# Altium project Graduation_Design.PrjPcb
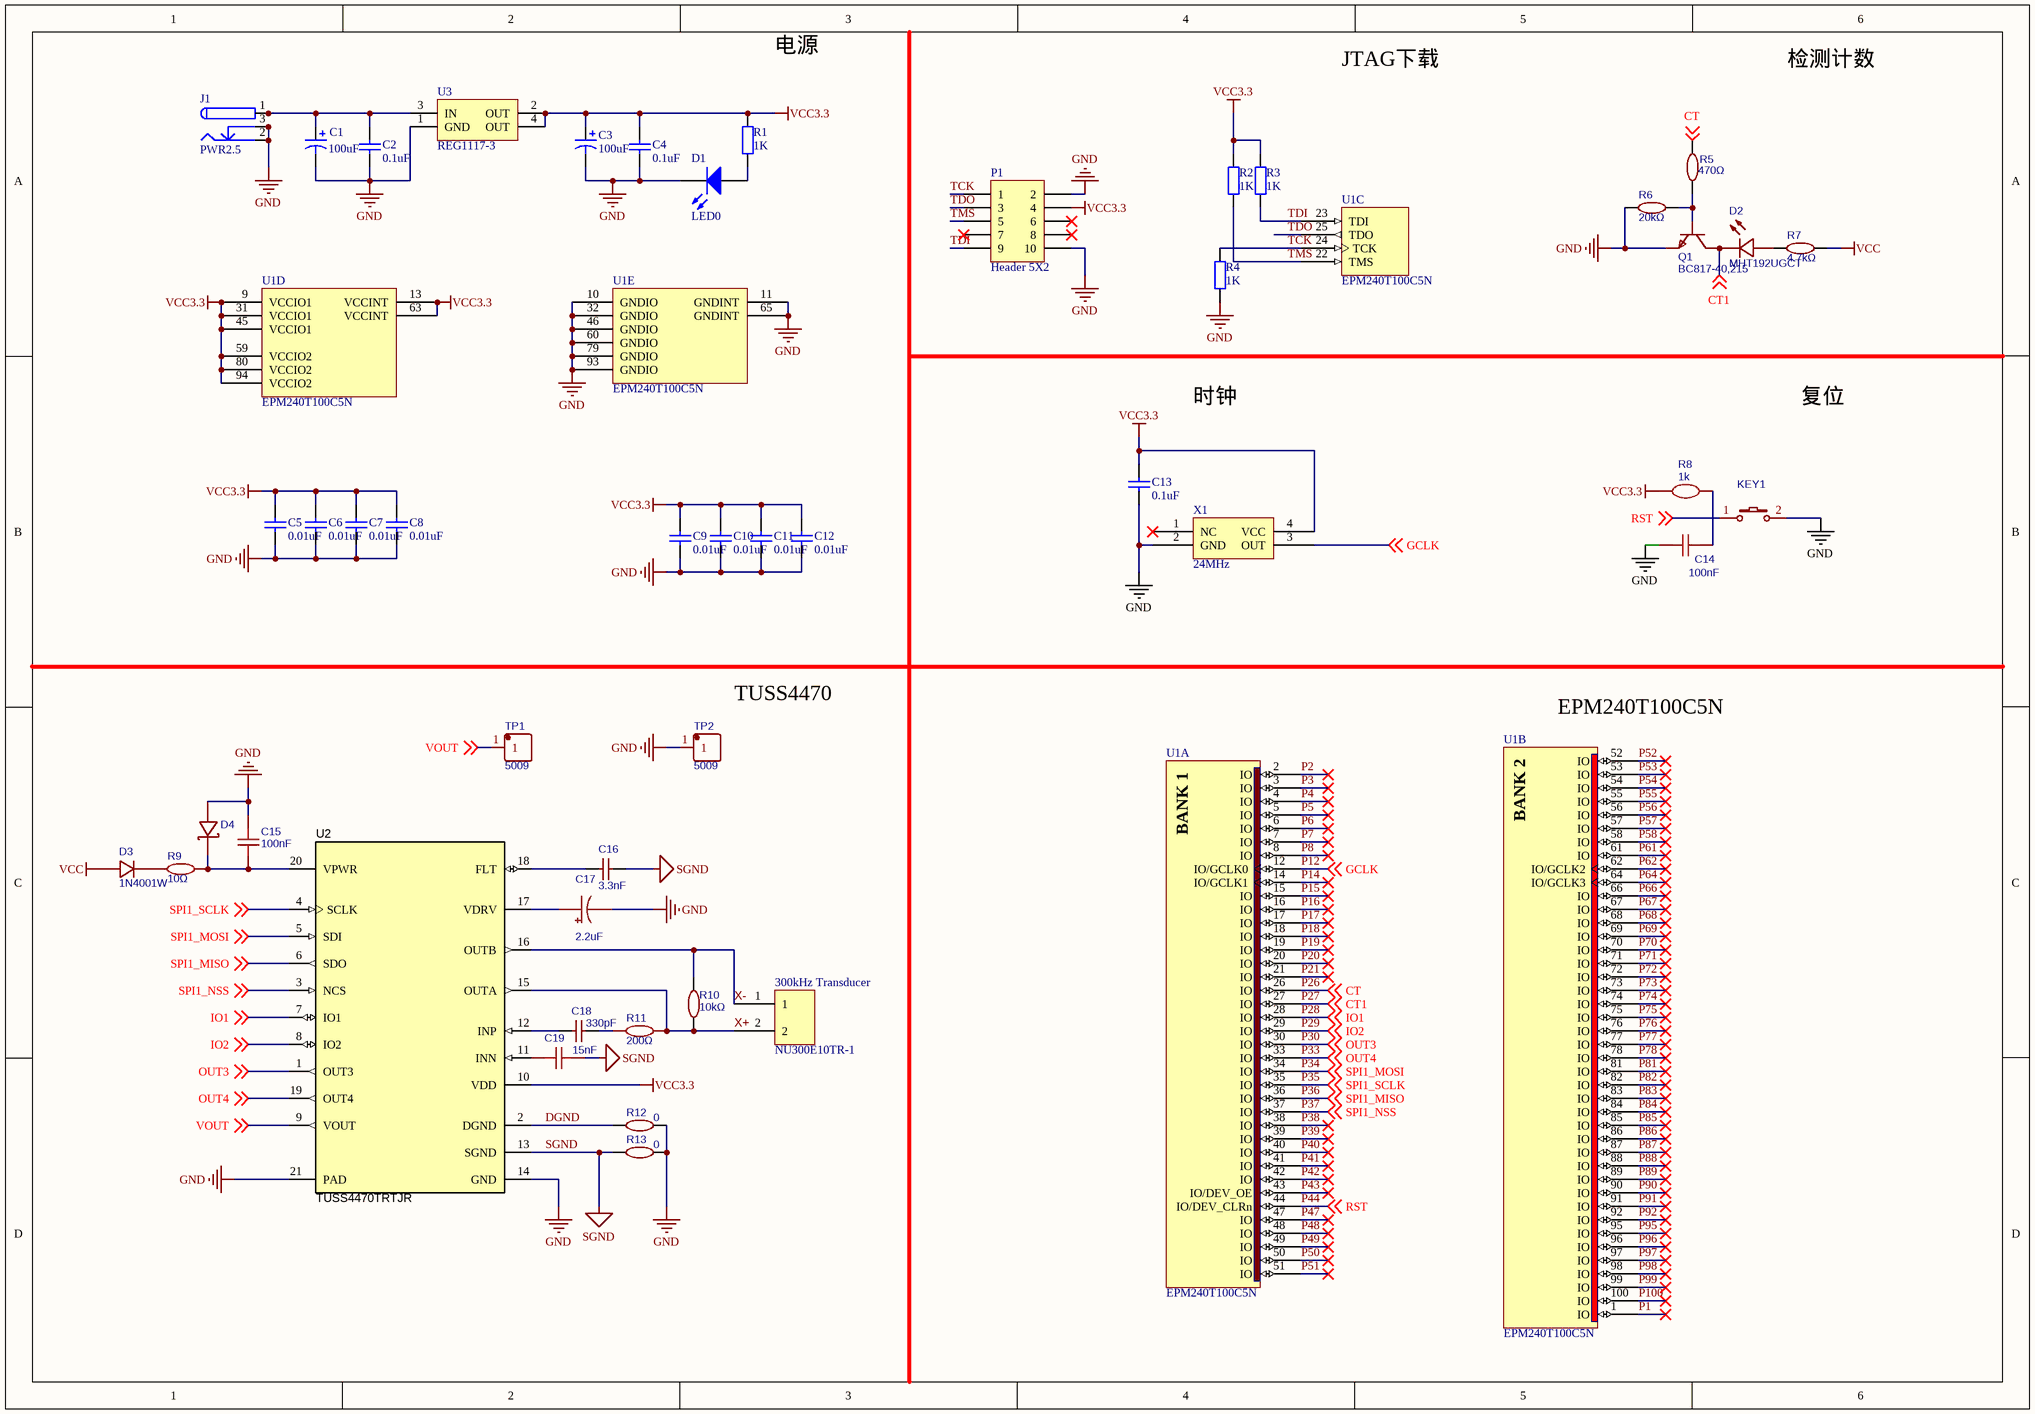
[diagram p0: 超声波接近电路2-22.SchDoc]
1 sheet, 47 parts. Net scope: global (net labels, ports and power ports of the same name join across sheets).
Board file: 超声波接近电路2-22PcbDoc.PcbDoc

## Sheet 超声波接近电路2-22.SchDoc
size 381 x 264 mm; SheetNumber: 1; SheetTotal: 1

### Parts
300kHz_Transducer  NU300E10TR-1  [NU300E10TR-1]
C1  value 100uF  [CAP-SMD_L3.2-W1.6-RD]  (hidden comment: Cap Pol1)
C2  value 0.1uF  [C0603]  (hidden comment: Cap)
C3  value 100uF  [CAP-SMD_L3.2-W1.6-RD]  (hidden comment: Cap Pol1)
C4  value 0.1uF  [C0603]  (hidden comment: Cap)
C5  value 0.01uF  [C0603]  (hidden comment: Cap)
C6  value 0.01uF  [C0603]  (hidden comment: Cap)
C7  value 0.01uF  [C0603]  (hidden comment: Cap)
C8  value 0.01uF  [C0603]  (hidden comment: Cap)
C9  value 0.01uF  [C0603]  (hidden comment: Cap)
C10  value 0.01uF  [C0603]  (hidden comment: Cap)
C11  value 0.01uF  [C0603]  (hidden comment: Cap)
C12  value 0.01uF  [C0603]  (hidden comment: Cap)
C13  value 0.1uF  [C0603]  (hidden comment: Cap)
C14  100nF  [C0603]
C15  100nF  [C0603]
C16  3.3nF  [C0603]
C17  2.2uF  [CAP-SMD_L3.2-W1.6-RD]
C18  330pF  [C0603]
C19  15nF  [C0603]
D1  LED0  [LED0603-RD_RED]
D2  MHT192UGCT  [LED0603-RD_GREEN]
D3  1N4001W  [SOD-123F_L2.8-W1.8-LS3.7-RD]
D4  SMF36A_C353286  [SOD-123FL_L2.7-W1.8-LS3.8-RD]  (value not drawn)
J1  PWR2.5  [KLD-0202]
KEY1  K2-3.6×6.1_SMD  [KEY-SMD_2P-L6.2-W3.6-LS8.0]  (value not drawn)
P1  Header 5X2  [HDR2X5]
Q1  BC817-40,215  [SOT-23-3_L2.9-W1.6-P1.90-LS2.8-BR]
R1  value 1K  [R0603]  (hidden comment: Res2)
R2  value 1K  [R0603]  (hidden comment: Res2)
R3  value 1K  [R0603]  (hidden comment: Res2)
R4  value 1K  [R0603]  (hidden comment: Res2)
R5  470Ω  [R0603]
R6  20kΩ  [R0603]
R7  4.7kΩ  [R0603]
R8  1k  [R0603]
R9  10Ω  [R0603]
R10  10kΩ  [R0603]
R11  200Ω  [R0603]
R12  0  [R0603]
R13  0  [R0603]
TP1  5009  [TEST-TH_BD3.18-P1.93]
TP2  5009  [TEST-TH_BD3.18-P1.93]
U1  EPM240T100C5N  [TQFP-100_L14.0-W14.0-P0.50-LS16.0-BL]  (parts A,B,C,D,E of 5)
U2  TUSS4470TRTJR  [QFN-20_L4.0-W4.0-P0.50-TL-EP2.7]
U3  REG1117-3  [ZZ311]
X1  24MHz  [OSC-SMD_4P-L7.0-W5.0-BL_SIT1602]

### Nets
GND: C1.2 C2.2 C3.2 C4.2 C5.1 C6.1 C7.1 C8.1 C9.1 C10.1 C11.1 C12.1 C13.1 C14.2 C15.2 C17.2 D1.2(K) D4.2(A) J1.2 J1.2A J1.2B J1.3 J1.3A J1.3B KEY1.2 P1.2 P1.10 Q1.2 R4.1 R6.1 R12.2 R13.2 TP2.1 U1.10(GNDIO) U1.11(GNDINT) U1.32(GNDIO) U1.46(GNDIO) U1.60(GNDIO) U1.65(GNDINT) U1.79(GNDIO) U1.93(GNDIO) U2.14(GND) U2.21(PAD) U3.1(GND) X1.2(GND)
SGND: C16.2 C19.2 R13.1 U2.13(SGND)
VCC: D3.2(A) R7.2
VCC3.3: C3.1 C4.1 C5.2 C6.2 C7.2 C8.2 C9.2 C10.2 C11.2 C12.2 C13.2 P1.4 R1.2 R2.2 R3.2 R8.2 U1.9(VCCIO1) U1.13(VCCINT) U1.31(VCCIO1) U1.45(VCCIO1) U1.59(VCCIO2) U1.63(VCCINT) U1.80(VCCIO2) U1.94(VCCIO2) U2.10(VDD) U3.2(OUT) U3.4(OUT) X1.4(VCC)
DGND: R12.1 U2.2(DGND)
P1: U1.1(IO)
P2: U1.2(IO)
P3: U1.3(IO)
P4: U1.4(IO)
P5: U1.5(IO)
P6: U1.6(IO)
P7: U1.7(IO)
P8: U1.8(IO)
P12: U1.12(IO/GCLK0) X1.3(OUT) ; off-sheet GCLK  [also labelled GCLK]
P14: U1.14(IO/GCLK1)
P15: U1.15(IO)
P16: U1.16(IO)
P17: U1.17(IO)
P18: U1.18(IO)
P19: U1.19(IO)
P20: U1.20(IO)
P21: U1.21(IO)
P26: R5.1 U1.26(IO) ; off-sheet CT  [also labelled CT]
P27: D2.1(-) Q1.3 U1.27(IO) ; off-sheet CT1  [also labelled CT1]
P28: U1.28(IO) U2.7(IO1) ; off-sheet IO1  [also labelled IO1]
P29: U1.29(IO) U2.8(IO2) ; off-sheet IO2  [also labelled IO2]
P30: U1.30(IO) U2.1(OUT3) ; off-sheet OUT3  [also labelled OUT3]
P33: U1.33(IO) U2.19(OUT4) ; off-sheet OUT4  [also labelled OUT4]
P34: U1.34(IO) U2.5(SDI) ; off-sheet SPI1_MOSI  [also labelled SPI1_MOSI]
P35: U1.35(IO) U2.4(SCLK) ; off-sheet SPI1_SCLK  [also labelled SPI1_SCLK]
P36: U1.36(IO) U2.6(SDO) ; off-sheet SPI1_MISO  [also labelled SPI1_MISO]
P37: U1.37(IO) U2.3(NCS) ; off-sheet SPI1_NSS  [also labelled SPI1_NSS]
P38: U1.38(IO)
P39: U1.39(IO)
P40: U1.40(IO)
P41: U1.41(IO)
P42: U1.42(IO)
P43: U1.43(IO/DEV_OE)
P44: KEY1.1 U1.44(IO/DEV_CLRn) ; off-sheet RST  [also labelled RST]
P47: U1.47(IO)
P48: U1.48(IO)
P49: U1.49(IO)
P50: U1.50(IO)
P51: U1.51(IO)
P52: U1.52(IO)
P53: U1.53(IO)
P54: U1.54(IO)
P55: U1.55(IO)
P56: U1.56(IO)
P57: U1.57(IO)
P58: U1.58(IO)
P61: U1.61(IO)
P62: U1.62(IO/GCLK2)
P64: U1.64(IO/GCLK3)
P66: U1.66(IO)
P67: U1.67(IO)
P68: U1.68(IO)
P69: U1.69(IO)
P70: U1.70(IO)
P71: U1.71(IO)
P72: U1.72(IO)
P73: U1.73(IO)
P74: U1.74(IO)
P75: U1.75(IO)
P76: U1.76(IO)
P77: U1.77(IO)
P78: U1.78(IO)
P81: U1.81(IO)
P82: U1.82(IO)
P83: U1.83(IO)
P84: U1.84(IO)
P85: U1.85(IO)
P86: U1.86(IO)
P87: U1.87(IO)
P88: U1.88(IO)
P89: U1.89(IO)
P90: U1.90(IO)
P91: U1.91(IO)
P92: U1.92(IO)
P95: U1.95(IO)
P96: U1.96(IO)
P97: U1.97(IO)
P98: U1.98(IO)
P99: U1.99(IO)
P100: U1.100(IO)
TCK: P1.1 R4.2 U1.24(TCK)
TDI: P1.9 R3.1 U1.23(TDI)
TDO: P1.3 U1.25(TDO)
TMS: P1.5 R2.1 U1.22(TMS)
VOUT: TP1.1 U2.9(VOUT) ; off-sheet VOUT
X+: 300kHz_Transducer.2 R10.1 R11.2 U2.15(OUTA)
X-: 300kHz_Transducer.1 R10.2 U2.16(OUTB)
NetC1_1: C1.1 C2.1 J1.1 J1.1A J1.1B U3.3(IN)
NetC14_1: C14.1 R8.1
NetC15_1: C15.1 D4.1(K) R9.2 U2.20(VPWR)
NetC16_1: C16.1 U2.18(FLT)
NetC17_1: C17.1 U2.17(VDRV)
NetC18_1: C18.1 U2.12(INP)
NetC18_2: C18.2 R11.1
NetC19_1: C19.1 U2.11(INN)
NetD1_1: D1.1(A) R1.1
NetD2_2: D2.2(+) R7.1
NetD3_1: D3.1(C) R9.1
NetQ1_1: Q1.1 R5.2 R6.2

Not connected (* = marked no-connect by the designer): P1 6* 7* 8*; X1 1(NC)*

### Notes on the sheet
- 电源
- JTAG下载
- 检测计数
- 时钟
- 复位
- TUSS4470
- (near U1) EPM240T100C5N
- (in symbol EPM240T100C5N, part A) BANK 1
- (in symbol EPM240T100C5N, part B) BANK 2

### Library data of the parts
C1 C3 = Cap Pol1: Polarized Capacitor (Radial); Published: 8-Jun-2000; LatestRevisionDate: 17-Jul-2002; LatestRevisionNote: Re-released for DXP Platform.; PackageReference: RB7.6-15; Publisher: Altium Limited
C2 C4-C13 = Cap: Capacitor; Published: 8-Jun-2000; LatestRevisionDate: 17-Jul-2002; LatestRevisionNote: Re-released for DXP Platform.; PackageReference: RAD-0.3; Publisher: Altium Limited
C14 = 100nF: nameAlias: Value(F); Contributor: LCEDA_Lib; spicePre: C; spiceSymbolName: C_0603_US
C15 = 100nF: BOM_Manufacturer: YAGEO; BOM_Manufacturer Part: CC0603KRX7R9BB104; nameAlias: Capacitance; BOM_Supplier: LCSC; BOM_Supplier Part: C14663; BOM_JLCPCB Part Class: Basic Part; spicePre: C; spiceSymbolName: CC0603KRX7R9BB104
C16 = 3.3nF: BOM_Manufacturer Part: GRM1885C1H332JA01D; BOM_Manufacturer: MuRata; nameAlias: Capacitance; BOM_Supplier: LCSC; BOM_Supplier Part: C77036; BOM_JLCPCB Part Class: Extended Part; spicePre: C; spiceSymbolName: GRM1885C1H332JA01D
C17 = 2.2uF_1: BOM_Manufacturer: KEMET; BOM_Manufacturer Part: T491A225K035AT; nameAlias: Capacitance; Contributor: LCSC; BOM_Supplier: LCSC; BOM_Supplier Part: C122264; BOM_JLCPCB Part Class: Extended Part; spicePre: C; spiceSymbolName: T491A225K035AT
C18 = 330pF: BOM_Manufacturer Part: CL10C331JB8NNNC; BOM_Manufacturer: SAMSUNG; nameAlias: Capacitance; BOM_Supplier: LCSC; BOM_Supplier Part: C1664; BOM_JLCPCB Part Class: Basic Part; spicePre: C; spiceSymbolName: CL10C331JB8NNNC
C19 = 15nF: BOM_Manufacturer: YAGEO; BOM_Manufacturer Part: CC0603JRX7R9BB153; nameAlias: Capacitance; Contributor: LCSC; BOM_Supplier: LCSC; BOM_Supplier Part: C519550; BOM_JLCPCB Part Class: Extended Part; spicePre: C; spiceSymbolName: CC0603JRX7R9BB153
D1 = LED0: Typical INFRARED GaAs LED; Published: 8-Jun-2000; LatestRevisionDate: 08-Jul-2005; LatestRevisionNote: Mech Layer 1 removed.; PackageReference: LED-0; Publisher: Altium Limited
D2 = MHT192UGCT: BOM_Manufacturer: MEIHUA; Contributor: LCSC; BOM_Supplier: LCSC; BOM_Supplier Part: C389519; BOM_Manufacturer Part: MHT192UGCT; BOM_JLCPCB Part Class: Extended Part; spicePre: L; spiceSymbolName: MHT192UGCT
D3 = 1N4001W: BOM_Manufacturer: Jingdao; Contributor: LCSC; BOM_Supplier Part: C162732; BOM_Supplier: LCSC; BOM_Manufacturer Part: 1N4001W; BOM_JLCPCB Part Class: Extended Part; spicePre: D; spiceSymbolName: 1N4001W
D4 = SMF36A_C353286: BOM_Manufacturer: Shandong Jingdao Microelectronics; BOM_Manufacturer Part: SMF36A; Contributor: LCSC; BOM_Supplier: LCSC; BOM_Supplier Part: C353286; BOM_JLCPCB Part Class: Extended Part; spicePre: D; spiceSymbolName: SMF36A_C353286
J1 = PWR2.5: Low Voltage Power Supply Connector; Published: 17-Dec-2003; DatasheetDocument: 09-May-2002; Publisher: Altium Limited; ComponentLink1Description: Manufacturer Link; ComponentLink1URL: http://domino.kycon.com/internet/Products.html
KEY1 = K2-3.6×6.1_SMD: BOM_Manufacturer Part: K2-1107ST-A4SW-06; Contributor: LCEDA_Lib; 制造商: 韩国韩荣; BOM_Supplier Part: C118141; BOM_Supplier: LCSC; spicePre: K; spiceSymbolName: K2-3.6×6.1_SMD
P1 = Header 5X2: Header, 5-Pin, Dual row; LatestRevisionDate: 17-Jul-2002; LatestRevisionNote: Re-released for DXP Platform.; Publisher: Altium Limited
Q1 = BC817-40,215: BOM_Manufacturer: Nexperia; BOM_Supplier: LCSC; BOM_Manufacturer Part: BC817-40,215; BOM_Supplier Part: C52801; BOM_JLCPCB Part Class: Extended Part; spicePre: Q; spiceSymbolName: BC817-40,215
R1-R4 = Res2: Resistor; Published: 8-Jun-2000; LatestRevisionDate: 17-Jul-2002; LatestRevisionNote: Re-released for DXP Platform.; PackageReference: AXIAL-0.4; Publisher: Altium Limited
R5 = 470Ω: BOM_Manufacturer: UniOhm; BOM_Manufacturer Part: 0603WAJ0471T5E; nameAlias: Resistance; Resistance (Ohms): 470; BOM_Supplier: LCSC; BOM_Supplier Part: C25241; BOM_JLCPCB Part Class: Extended Part; spicePre: R; spiceSymbolName: 0603WAJ0471T5E
R6 = 20kΩ: BOM_Manufacturer: UniOhm; BOM_Manufacturer Part: 0603WAF2002T5E; nameAlias: Resistance; Resistance (Ohms): 20K; BOM_Supplier: LCSC; BOM_Supplier Part: C4184; BOM_JLCPCB Part Class: Basic Part; spicePre: R; spiceSymbolName: 0603WAF2002T5E
R7 = 4.7kΩ: BOM_Manufacturer: UniOhm; BOM_Manufacturer Part: 0603WAF4701T5E; nameAlias: Resistance; Resistance (Ohms): 4.7K; BOM_Supplier: LCSC; BOM_Supplier Part: C23162; BOM_JLCPCB Part Class: Basic Part; spicePre: R; spiceSymbolName: 0603WAF4701T5E
R8 = 1k: nameAlias: Value(Ω); Contributor: LCEDA_Lib; spicePre: R; spiceSymbolName: R_0603_EU
R9 = 10Ω: BOM_Manufacturer: PANASONIC; BOM_Manufacturer Part: ERJPA3J100V; Resistance (Ohms): 10; nameAlias: Resistance; Contributor: LCSC; BOM_Supplier: LCSC; BOM_Supplier Part: C441879; BOM_JLCPCB Part Class: Extended Part; spicePre: R; spiceSymbolName: ERJPA3J100V
R10 = 10kΩ: BOM_Manufacturer: UniOhm; BOM_Manufacturer Part: 0603WAF1002T5E; nameAlias: Resistance; Resistance (Ohms): 10K; BOM_Supplier: LCSC; BOM_Supplier Part: C25804; BOM_JLCPCB Part Class: Basic Part; spicePre: R; spiceSymbolName: 0603WAF1002T5E
R11 = 200Ω: BOM_Manufacturer: PANASONIC; BOM_Manufacturer Part: ERJ-PA3F2000V; Resistance (Ohms): 200; nameAlias: Resistance; Contributor: LCSC; BOM_Supplier: LCSC; BOM_Supplier Part: C254528; BOM_JLCPCB Part Class: Extended Part; spicePre: R; spiceSymbolName: ERJ-PA3F2000V
R12 R13 = 0_1: BOM_Manufacturer: YAGEO; BOM_Manufacturer Part: RC0603JR-070RL; nameAlias: Resistance (Ohms); Resistance: 0Ω; BOM_Supplier: LCSC; BOM_Supplier Part: C95177; BOM_JLCPCB Part Class: Extended Part; spicePre: R; spiceSymbolName: RC0603JR-070RL
TP1 TP2 = 5009: BOM_Manufacturer: Keystone; Contributor: LCSC; BOM_Supplier: LCSC; BOM_Supplier Part: C238126; BOM_Manufacturer Part: 5009; BOM_JLCPCB Part Class: Extended Part; spicePre: U; spiceSymbolName: 5009
U1 = EPM240T100C5N: MAX II 3.3/2.5V CPLD, 80 IOs, 240 Logic Elements, 100-Pin Plastic TQFP, Commercial Temperature, Speed Grade 5, Pb-Free; Note: Each set of VCCIO pins can be connected to 3.3V, 2.5V, 1.8V, or 1.5V.; Note: All VCCINT pins must be connected to either 3.3V or 2.5V (but not a combination of both).; Published: 4-Mar-2005; LatestRevisionDate: 13-Apr-2006; LatestRevisionNote: IPC-7351 Footprint Added.; DatasheetVersion: ver1.8, Jul-2006; PackageVersion: ver15.1, May-2008; PackageReference: TQFP100; Publisher: Altium Limited; PackageDescription: 100-Pin Plastic Thin Quad Flat Pack (TQFP100) - Wire Bond; Supplier 1: Digi-Key; Supplier Part Number 1: 544-1964-ND; Supplier 2: Farnell; Supplier Part Number 2: 1662268; Supplier 3: Farnell; Supplier Part Number 3: 1453503; Code_JEDEC: MS-026-AED; ComponentLink1Description: Manufacturer Link; ComponentLink1URL: http://www.altera.com/products/devices/cpld/max2/mx2-index.jsp; ComponentLink2Description: Handbook; ComponentLink2URL: http://www.altera.com/literature/hb/max2/max2_mii5v1.pdf; ComponentLink3Description: Packaging Specification; ComponentLink3URL: http://www.altera.com/literature/ds/dspkg.pdf
U2 = CMP-0081414-4: Ultrasonic Sensor Signal Conditioner IC for Directly; Manufacturer: Texas Instruments; Alternate PartNumber: PGA44801RTJT; AEC Qualified: N; SizeAreaWB_mm2: 25; SizeZ_mm: 0.8; SizeX_mm: 4; AEC Category: Q200; SizeArea_mm2: 16; ComponentLink3URL: http://www.ti.com/product/pga448/datasheet; ComponentLink1URL: http://www.ti.com/lit/ds/symlink/pga448.pdf; MountType: SMT; ComponentLink2Description: Product Folder; ComponentLink3Description: Online Datasheet; ComponentLink2URL: http://www.ti.com/product/pga448; PackageDescription: WQFN-20; SizeY_mm: 4; ComponentLink1Description: Datasheet Link; PackageReference: RTJ0020J; Alternate Manufacturer: Texas Instruments; CompType: IC; PartNumber: TUSS4470TRTJR
U3 = REG1117-3: 800mA Low Dropout Positive Regulator Fixed 2.85V,3V,3.3V and 5V; Published: 8-Jun-2000; LatestRevisionDate: 17-Jul-2002; LatestRevisionNote: Re-released for DXP Platform.; DatasheetVersion: 1994; PackageVersion: revC; PackageReference: ZZ311; Publisher: Altium Limited; PackageDescription: SOT-223/SC-73; 4 Leads; Body 6.7 x 7.3 mm, inc. leads (LxW max); ComponentLink1Description: Manufacturer Link; ComponentLink1URL: http://www.ti.com/; ComponentLink2Description: Datasheet; ComponentLink2URL: http://www-s.ti.com/sc/ds/reg1117.pdf
X1 = oscillator